# EAGLE schematic SCHEMATIC (EAGLE 7.2.0)
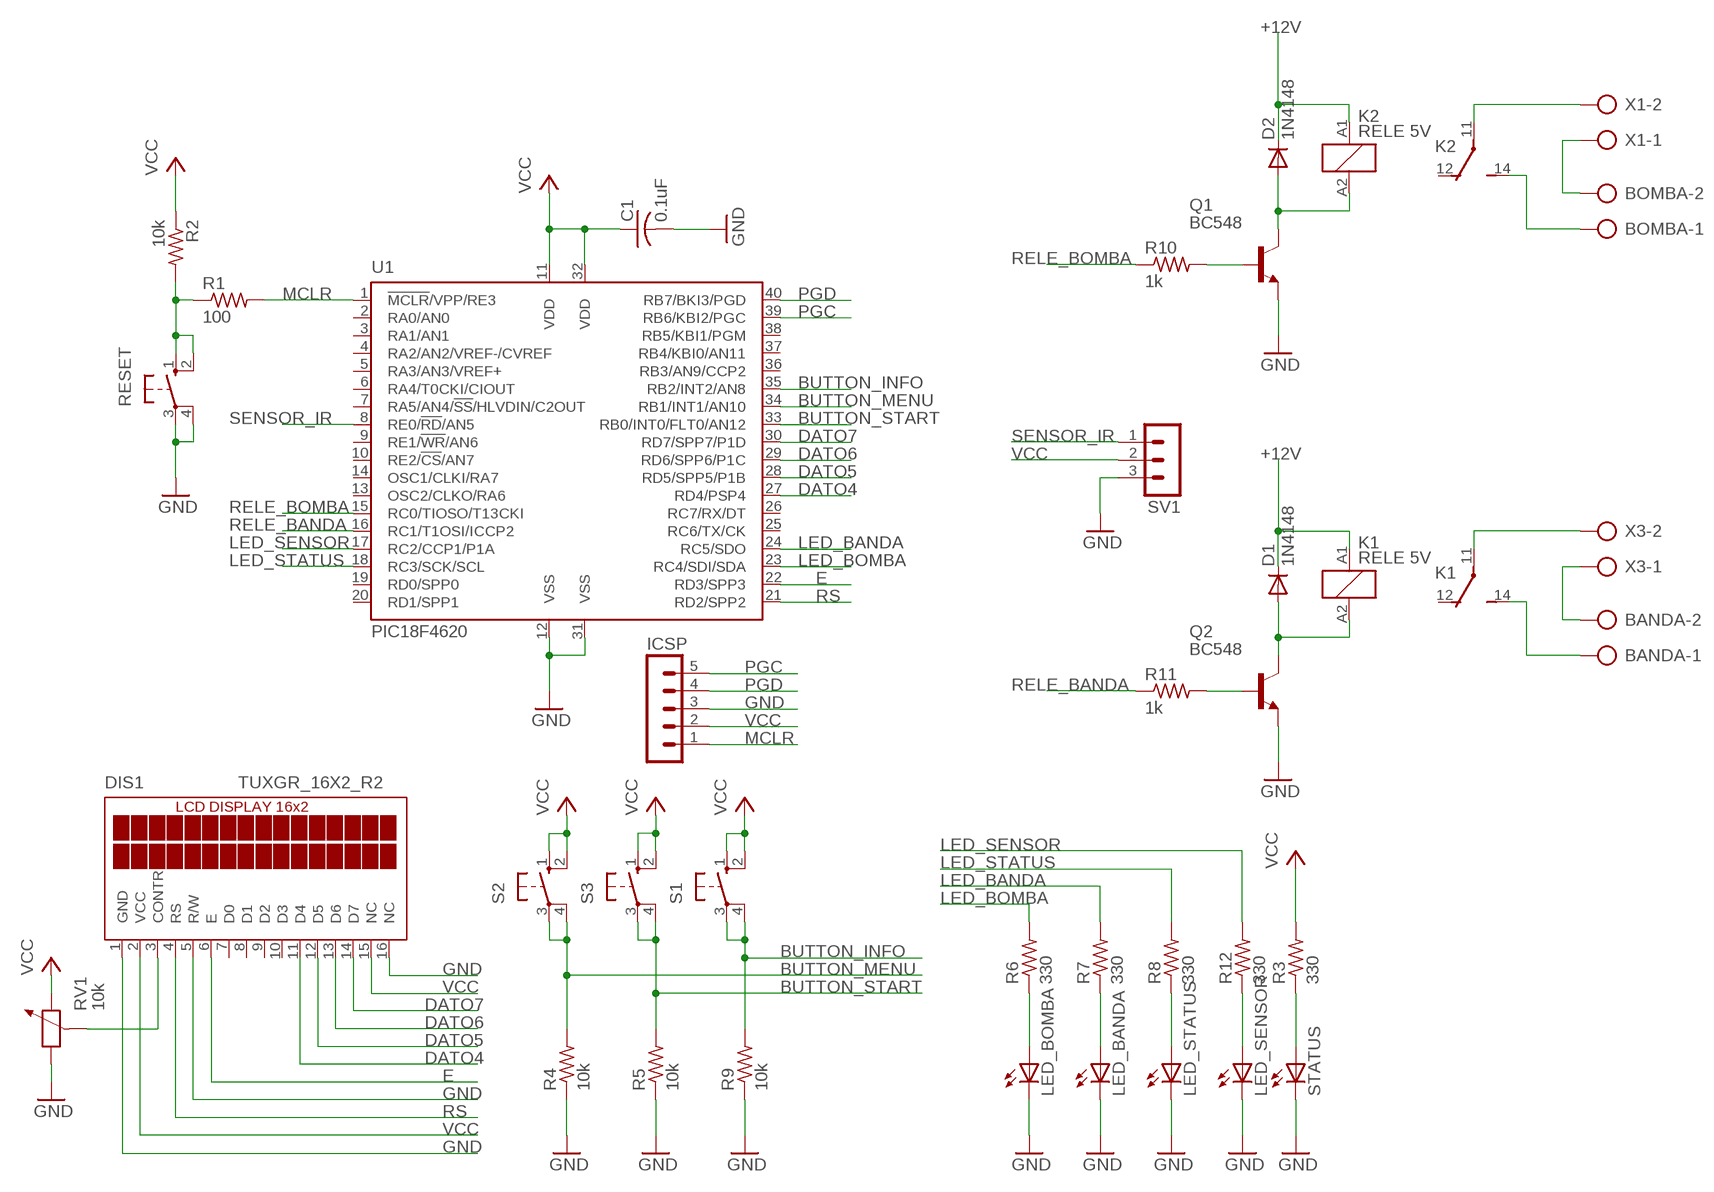
[diagram p0: schematic, sheet 1]

## Parts
BANDA  AK500/2  [AK500/2]
BOMBA  AK500/2  [AK500/2]
C1  0.1uF  C-US025-030X050  [C025-030X050]
D1  1N4148  1N4148DO35-7  [DO35-7]
D2  1N4148  1N4148DO35-7  [DO35-7]
DIS1  TUXGR_16X2_R2  [TUXGR_16X2_R2]
ICSP  MA05-1  [MA05-1]
K1  RELE 5V  ZNS5106  [ZN5]
K2  RELE 5V  ZNS5106  [ZN5]
LED_BANDA  LED5MM  [LED5MM]
LED_BOMBA  LED5MM  [LED5MM]
LED_SENSOR  LED5MM  [LED5MM]
LED_STATUS  LED5MM  [LED5MM]
Q1  BC548  [TO92-EBC]
Q2  BC548  [TO92-EBC]
R1  100  R-US_0207/7  [0207/7]
R2  10k  R-US_0207/7  [0207/7]
R3  330  R-US_0207/7  [0207/7]
R4  10k  R-US_0204/7  [0204/7]
R5  10k  R-US_0204/7  [0204/7]
R6  330  R-US_0204/7  [0204/7]
R7  330  R-US_0204/7  [0204/7]
R8  330  R-US_0207/7  [0207/7]
R9  10k  R-US_0204/7  [0204/7]
R10  1k  R-US_0207/7  [0207/7]
R11  1k  R-US_0207/7  [0207/7]
R12  330  R-US_0207/7  [0207/7]
RESET  10-XX  [B3F-10XX]
RV1  10k  POTENCIOMETRO  [POT]
S1  10-XX  [B3F-10XX]
S2  10-XX  [B3F-10XX]
S3  10-XX  [B3F-10XX]
STATUS  LED5MM  [LED5MM]
SV1  MA03-1  [MA03-1]
U1  PIC18F4620  PIC18F4620DIP  [DIL40]
X1  AK500/2  [AK500/2]
X3  AK500/2  [AK500/2]

## Nets
+12V: D1.C D2.C K1.A1 K2.A1
BUTTON_INFO: R9.2 S1.3(P) S1.4(P1) U1.35(RB2/INT2/AN8)
BUTTON_MENU: R4.2 S2.3(P) S2.4(P1) U1.34(RB1/INT1/AN10)
BUTTON_START: R5.2 S3.3(P) S3.4(P1) U1.33(RB0/INT0/FLT0/AN12)
DATO4: DIS1.11(D4) U1.27(RD4/PSP4)
DATO5: DIS1.12(D5) U1.28(RD5/SPP5/P1B)
DATO6: DIS1.13(D6) U1.29(RD6/SPP6/P1C)
DATO7: DIS1.14(D7) U1.30(RD7/SPP7/P1D)
E: DIS1.6(E) U1.22(RD3/SPP3)
GND: C1.2 DIS1.1(GND) DIS1.5(R/W) DIS1.16(NC) ICSP.3 LED_BANDA.K(C) LED_BOMBA.K(C) LED_SENSOR.K(C) LED_STATUS.K(C) Q1.E Q2.E R4.1 R5.1 R9.1 RESET.3(P) RESET.4(P1) RV1.1 STATUS.K(C) SV1.3 U1.12(VSS) U1.31(VSS)
LED_BANDA: R7.2 U1.24(RC5/SDO)
LED_BOMBA: R6.2 U1.23(RC4/SDI/SDA)
LED_SENSOR: R12.2 U1.17(RC2/CCP1/P1A)
LED_STATUS: R8.2 U1.18(RC3/SCK/SCL)
MCLR: ICSP.1 R1.2 U1.1(!MCLR!/VPP/RE3)
N$1: R3.1 STATUS.A
N$2: LED_STATUS.A R8.1
N$3: Q1.B R10.2
N$4: DIS1.3(CONTR) RV1.3
N$5: D2.A K2.A2 Q1.C
N$6: Q2.B R11.2
N$7: LED_SENSOR.A R12.1
N$8: R1.1 R2.2 RESET.1(S) RESET.2(S1)
N$9: BOMBA.2 X1.1
N$10: D1.A K1.A2 Q2.C
N$11: LED_BOMBA.A R6.1
N$12: LED_BANDA.A R7.1
N$13: K2.11(2:P) X1.2
N$14: BOMBA.1 K2.14(2:S)
N$15: BANDA.2 X3.1
N$16: K1.11(2:P) X3.2
N$17: BANDA.1 K1.14(2:S)
PGC: ICSP.5 U1.39(RB6/KBI2/PGC)
PGD: ICSP.4 U1.40(RB7/BKI3/PGD)
RELE_BANDA: R11.1 U1.16(RC1/T1OSI/ICCP2)
RELE_BOMBA: R10.1 U1.15(RC0/TIOSO/T13CKI)
RS: DIS1.4(RS) U1.21(RD2/SPP2)
SENSOR_IR: SV1.1 U1.8(RE0/!RD!/AN5)
VCC: C1.1 DIS1.2(VCC) DIS1.15(NC) ICSP.2 R2.1 R3.2 RV1.2 S1.1(S) S1.2(S1) S2.1(S) S2.2(S1) S3.1(S) S3.2(S1) SV1.2 U1.11(VDD) U1.32(VDD)
Unconnected: DIS1.7(D0) DIS1.8(D1) DIS1.9(D2) DIS1.10(D3) K1.12(2:O) K2.12(2:O) U1.2(RA0/AN0) U1.3(RA1/AN1) U1.4(RA2/AN2/VREF-/CVREF) U1.5(RA3/AN3/VREF+) U1.6(RA4/T0CKI/CIOUT) U1.7(RA5/AN4/!SS!/HLVDIN/C2OUT) U1.9(RE1/!WR!/AN6) U1.10(RE2/!CS!/AN7) U1.13(OSC2/CLKO/RA6) U1.14(OSC1/CLKI/RA7) U1.19(RD0/SPP0) U1.20(RD1/SPP1) U1.25(RC6/TX/CK) U1.26(RC7/RX/DT) U1.36(RB3/AN9/CCP2) U1.37(RB4/KBI0/AN11) U1.38(RB5/KBI1/PGM)

## Library data of the parts
BANDA BOMBA X1 X3 = con-ptr500:AK500/2: CONNECTOR
C1 = resistor:C-US: CAPACITOR, American symbol
D1 D2 = diode:1N4148: DIODE high speed (Philips)
DIS1 = display-lcd:TUXGR_16X2_R2: Tuxgraphics LCD display 16x2 characters reflective, without background light Source: tuxgr_12x2_r2.pdf
ICSP = con-lstb:MA05-1: PIN HEADER
K1 K2 = relay:ZNS5*: Miniature Power PCB Relay SCHRACK 1pole 10 A Source: http://www.schrack.com/.. 5847.pdf
LED_BANDA LED_BOMBA LED_SENSOR LED_STATUS STATUS = led:LED: LED OSRAM: - CHIPLED LG R971, LG N971, LY N971, LG Q971, LY Q971, LO R971, LY R971 LH N974, LH R974 LS Q976, LO Q976, LY Q976 LO Q996 - Hyper CHIPLED LW Q18S LB Q993, LB Q99A, LB R99A - SideLED LS A670, LO A670, LY A670, LG A670, LP A670 LB A673, LV A673, LT A673, LW A673 LH A674 LY A675 LS A676, LA A676, LO A676, LY A676, LW A676 LS A679, LY A679, LG A679 - Hyper Micro SIDELED® LS Y876, LA Y876, LO Y876, LY Y876 LT Y87S - SmartLED LW L88C, LW L88S LB L89C, LB L89S, LG L890 LS L89K, LO L89K, LY L89K LS L896, LA L896, LO L896, LY L896 - TOPLED LS T670, LO T670, LY T670, LG T670, LP T670 LSG T670, LSP T670, LSY T670, LOP T670, LYG T670 LG T671, LOG T671, LSG T671 LB T673, LV T673, LT T673, LW T673 LH T674 LS T676, LA T676, LO T676, LY T676, LB T676, LH T676, LSB T676, LW T676 LB T67C, LV T67C, LT T67C, LS T67K, LO T67K, LY T67K, LW E67C LS E67B, LA E67B, LO E67B, LY E67B, LB E67C, LV E67C, LT E67C LW T67C LS T679, LY T679, LG T679 LS T770, LO T770, LY T770, LG T770, LP T770 LB T773, LV T773, LT T773, LW T773 LH T774 LS E675, LA E675, LY E675, LS T675 LS T776, LA T776, LO T776, LY T776, LB T776 LHGB T686 LT T68C, LB T68C - Hyper Mini TOPLED® LB M676 - Mini TOPLED Santana® LG M470 LS M47K, LO M47K, LY M47K Source: http://www.osram.convergy.de LUXEON: - LUMILED® LXK2-PW12-R00, LXK2-PW12-S00, LXK2-PW14-U00, LXK2-PW14-V00 LXK2-PM12-R00, LXK2-PM12-S00, LXK2-PM14-U00 LXK2-PE12-Q00, LXK2-PE12-R00, LXK2-PE12-S00, LXK2-PE14-T00, LXK2-PE14-U00 LXK2-PB12-K00, LXK2-PB12-L00, LXK2-PB12-M00, LXK2-PB14-N00, LXK2-PB14-P00, LXK2-PB14-Q00 LXK2-PR12-L00, LXK2-PR12-M00, LXK2-PR14-Q00, LXK2-PR14-R00 LXK2-PD12-Q00, LXK2-PD12-R00, LXK2-PD12-S00 LXK2-PH12-R00, LXK2-PH12-S00 LXK2-PL12-P00, LXK2-PL12-Q00, LXK2-PL12-R00 Source: www.luxeon.com KINGBRIGHT: KA-3528ASYC Source: www.kingbright.com
Q1 Q2 = transistor-npn:BC548*: NPN Transistor
R1-R3 R8 R10-R12 = resistor:R-US_: RESISTOR, American symbol
R4-R7 R9 = rcl:R-US_: RESISTOR, American symbol
RESET S1-S3 = switch-omron:10-XX: OMRON SWITCH
RV1 = 1 ELECTRÓNICA Y ROBÓTICA:POTENCIOMETRO: Potenciometro 3 pines
SV1 = con-lstb:MA03-1: PIN HEADER
U1 = 1 ELECTRÓNICA Y ROBÓTICA:PIC18F4620: PIC18F4620